# EAGLE schematic UVBoxSchematic_1.0 (EAGLE 7.6.0)
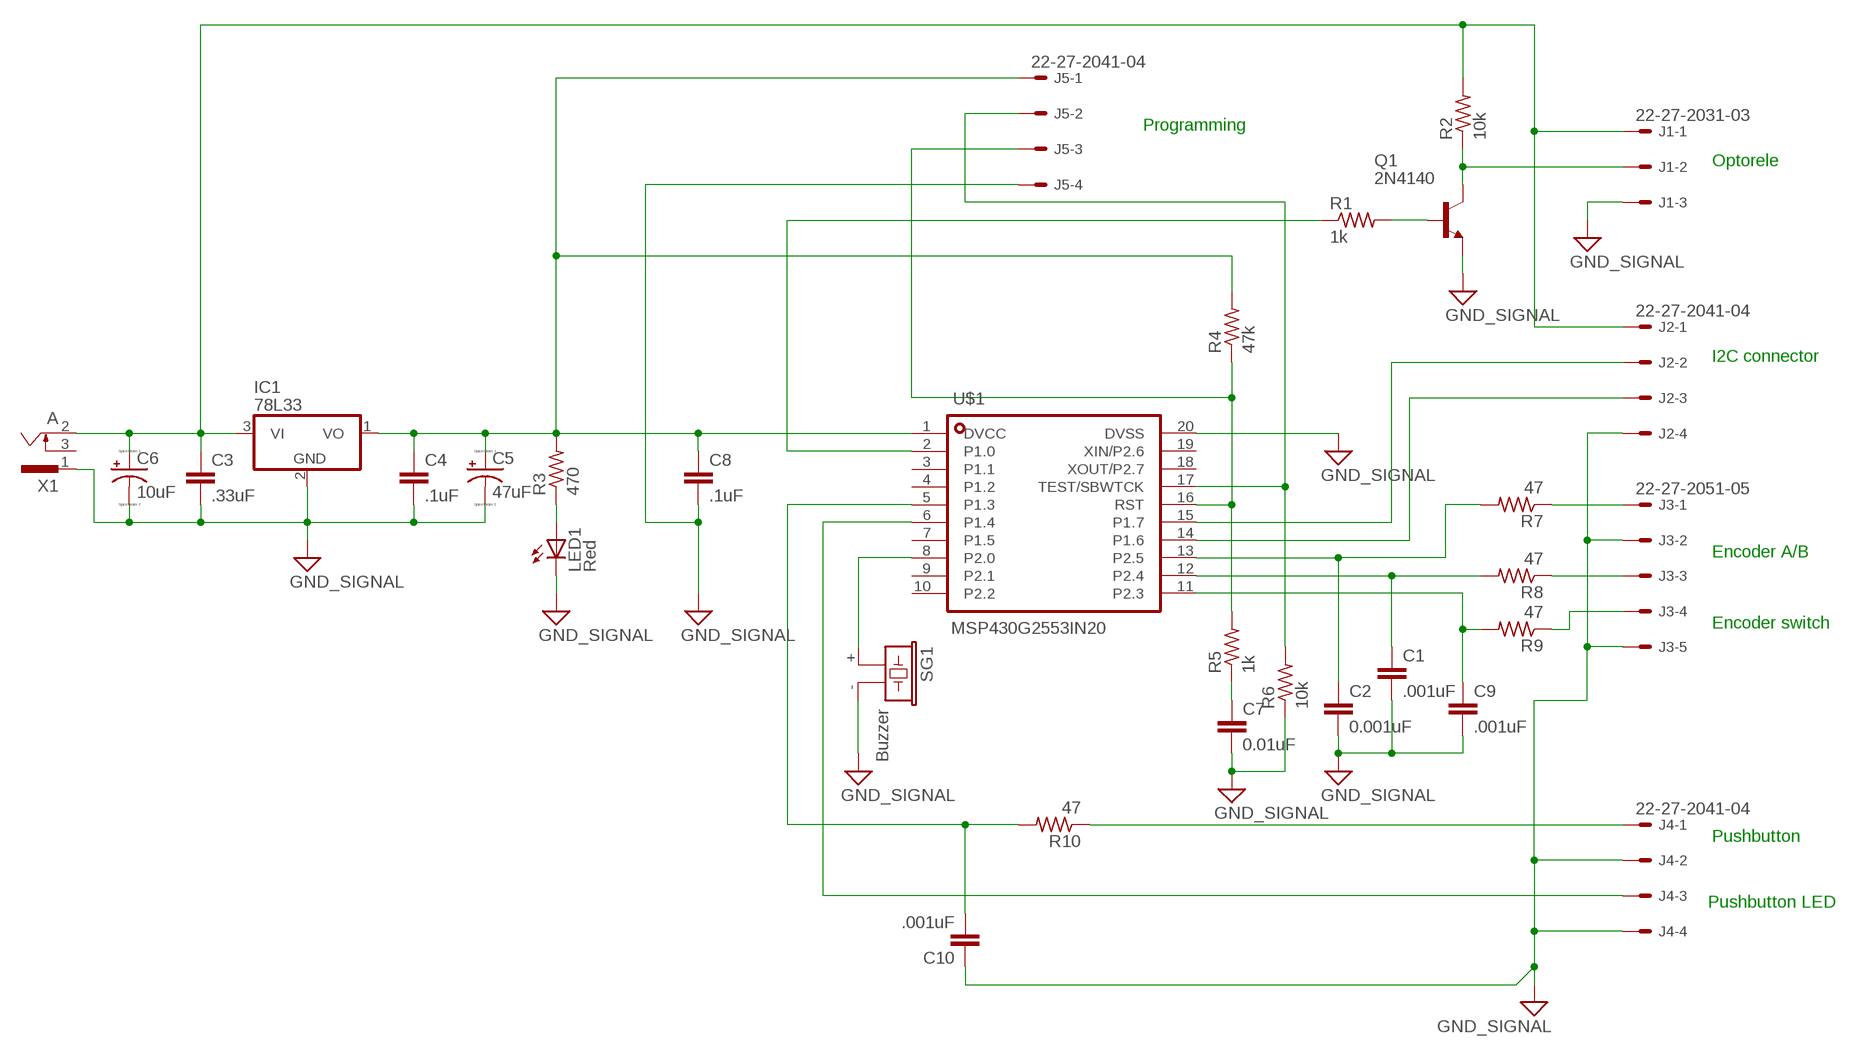
[diagram p0: schematic, sheet 1]

## Parts
C1  .001uF  C2.5/2  [C2.5-2]
C2  0.001uF  C2.5/2  [C2.5-2]
C3  .33uF  C2.5/2  [C2.5-2]
C4  .1uF  C2.5/2  [C2.5-2]
C5  47uF  CPOL-USB45181A  [B45181A]
C6  10uF  CPOL-USB45181A  [B45181A]
C7  0.01uF  C2.5/2  [C2.5-2]
C8  .1uF  C2.5/2  [C2.5-2]
C9  .001uF  C2.5/2  [C2.5-2]
C10  .001uF  C2.5/2  [C2.5-2]
IC1  78L33  78L05Z  [TO92]
J1  22-27-2031-03  [6410-03]
J2  22-27-2041-04  [6410-04]
J3  22-27-2051-05  [6410-05]
J4  22-27-2041-04  [6410-04]
J5  22-27-2041-04  [6410-04]
LED1  Red  LED3MM  [LED3MM]
Q1  2N4140  2N4104  [TO18]
R1  1k  R-US_0204/7  [0204/7]
R2  10k  R-US_0204/7  [0204/7]
R3  470  R-US_0204/7  [0204/7]
R4  47k  R-US_0204/7  [0204/7]
R5  1k  R-US_0204/7  [0204/7]
R6  10k  R-US_0204/7  [0204/7]
R7  47  R-US_0204/7  [0204/7]
R8  47  R-US_0204/7  [0204/7]
R9  47  R-US_0204/7  [0204/7]
R10  47  R-US_0204/7  [0204/7]
SG1  Buzzer  F/CM04P  [F/CM04P]
U$1  MSP430G2553IN20  [DIP20]
X1  A  SCD-014A  [SCD-014-A]

## Nets
+3V3: C4.1 C5.+ C8.1 IC1.1(VO) J5.1 R3.2 R4.2 U$1.1(DVCC)
GND: C1.2 C2.2 C3.2 C4.2 C5.- C6.- C7.2 C8.2 C9.2 C10.1 IC1.2(GND) J1.3 J2.4 J3.2 J3.5 J4.2 J4.4 J5.4 LED1.K(C) Q1.1(E) R6.1 SG1.- U$1.20(DVSS) X1.1 ; supply symbol labelled GND_SIGNAL
N$1: C3.1 C6.+ IC1.3(VI) J1.1 J2.1 R2.2 X1.2
N$2: C2.1 R7.2 U$1.13(P2.5)
N$3: C1.1 R8.2 U$1.12(P2.4)
N$5: J2.3 U$1.14(P1.6)
N$6: J2.2 U$1.15(P1.7)
N$7: LED1.A R3.1
N$9: C10.2 R10.2 U$1.5(P1.3)
N$10: C7.1 R5.1
N$11: J1.2 Q1.3(C) R2.1
N$12: Q1.2(B) R1.2
N$13: R1.1 U$1.2(P1.0)
N$14: J4.3 U$1.6(P1.4)
N$15: SG1.+ U$1.8(P2.0)
N$16: J5.2 R6.2 U$1.17(TEST/SBWTCK)
N$17: J3.3 R8.1
N$18: J4.1 R10.1
N$19: J5.3 R4.1 R5.2 U$1.16(RST)
N$20: J3.1 R7.1
N$22: C9.1 R9.2 U$1.11(P2.3)
N$23: J3.4 R9.1
Unconnected: U$1.3(P1.1) U$1.4(P1.2) U$1.7(P1.5) U$1.9(P2.1) U$1.10(P2.2) U$1.18(XOUT/P2.7) U$1.19(XIN/P2.6) X1.3

## Notes on the sheet
- Programming
- Optorele
- I2C connector
- Encoder A/B
- Encoder switch
- Pushbutton
- Pushbutton LED

## Library data of the parts
C1 C9 C10 = capacitor-wima:C: CAPACITOR naming: grid - package width; A: 10
C2-C4 C7 C8 = capacitor-wima:C: CAPACITOR naming: grid - package width
C5 C6 = resistor:CPOL-US: POLARIZED CAPACITOR, American symbol
IC1 = linear:78*: Positive VOLTAGE REGULATOR Source: http://cache.national.com/ds/LM/LM78L05.pdf http://www.fairchildsemi.com/ds/LM/LM7805.pdf
J1 = con-molex:22-?-03: CONNECTOR wire to board 2.54 mm (.1 inch) pitch header; OC_FARNELL: unknown; OC_NEWARK: unknown
J2 J4 J5 = con-molex:22-?-04: CONNECTOR wire to board 2.54 mm (.1 inch) pitch header; OC_FARNELL: unknown; OC_NEWARK: unknown
J3 = con-molex:22-?-05: CONNECTOR wire to board 2.54 mm (.1 inch) pitch header; OC_FARNELL: unknown; OC_NEWARK: unknown
LED1 = led:LED: LED OSRAM: - CHIPLED LG R971, LG N971, LY N971, LG Q971, LY Q971, LO R971, LY R971 LH N974, LH R974 LS Q976, LO Q976, LY Q976 LO Q996 - Hyper CHIPLED LW Q18S LB Q993, LB Q99A, LB R99A - SideLED LS A670, LO A670, LY A670, LG A670, LP A670 LB A673, LV A673, LT A673, LW A673 LH A674 LY A675 LS A676, LA A676, LO A676, LY A676, LW A676 LS A679, LY A679, LG A679 - Hyper Micro SIDELED® LS Y876, LA Y876, LO Y876, LY Y876 LT Y87S - SmartLED LW L88C, LW L88S LB L89C, LB L89S, LG L890 LS L89K, LO L89K, LY L89K LS L896, LA L896, LO L896, LY L896 - TOPLED LS T670, LO T670, LY T670, LG T670, LP T670 LSG T670, LSP T670, LSY T670, LOP T670, LYG T670 LG T671, LOG T671, LSG T671 LB T673, LV T673, LT T673, LW T673 LH T674 LS T676, LA T676, LO T676, LY T676, LB T676, LH T676, LSB T676, LW T676 LB T67C, LV T67C, LT T67C, LS T67K, LO T67K, LY T67K, LW E67C LS E67B, LA E67B, LO E67B, LY E67B, LB E67C, LV E67C, LT E67C LW T67C LS T679, LY T679, LG T679 LS T770, LO T770, LY T770, LG T770, LP T770 LB T773, LV T773, LT T773, LW T773 LH T774 LS E675, LA E675, LY E675, LS T675 LS T776, LA T776, LO T776, LY T776, LB T776 LHGB T686 LT T68C, LB T68C - Hyper Mini TOPLED® LB M676 - Mini TOPLED Santana® LG M470 LS M47K, LO M47K, LY M47K Source: http://www.osram.convergy.de LUXEON: - LUMILED® LXK2-PW12-R00, LXK2-PW12-S00, LXK2-PW14-U00, LXK2-PW14-V00 LXK2-PM12-R00, LXK2-PM12-S00, LXK2-PM14-U00 LXK2-PE12-Q00, LXK2-PE12-R00, LXK2-PE12-S00, LXK2-PE14-T00, LXK2-PE14-U00 LXK2-PB12-K00, LXK2-PB12-L00, LXK2-PB12-M00, LXK2-PB14-N00, LXK2-PB14-P00, LXK2-PB14-Q00 LXK2-PR12-L00, LXK2-PR12-M00, LXK2-PR14-Q00, LXK2-PR14-R00 LXK2-PD12-Q00, LXK2-PD12-R00, LXK2-PD12-S00 LXK2-PH12-R00, LXK2-PH12-S00 LXK2-PL12-P00, LXK2-PL12-Q00, LXK2-PL12-R00 Source: www.luxeon.com KINGBRIGHT: KA-3528ASYC Source: www.kingbright.com
Q1 = transistor-npn:2N4104: NPN Transistor
R1-R10 = resistor:R-US_: RESISTOR, American symbol
SG1 = buzzer:F/CM04P: BUZZER Source: Buerklin; OC_FARNELL: unknown; OC_NEWARK: unknown
U$1 = GuShH:MSP430G2553
X1 = con-shiua-chyuan:SCD-014A: Power Jack 2.5mm; OC_FARNELL: unknown; OC_NEWARK: unknown

## Net classes
0 default: width 0.305 mm, drill 0.5 mm, clearance 0.305 mm